# EAGLE design breakouts (EAGLE 9.0.1)
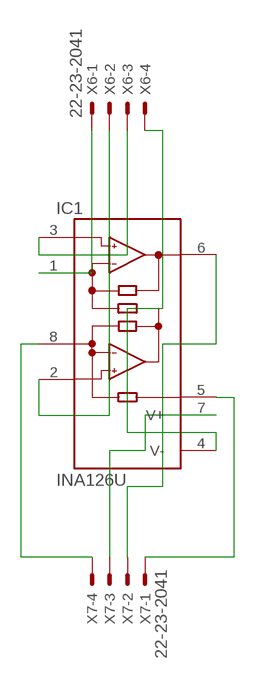
[diagram p0: schematic, sheet 1]

## Parts
IC1  INA126U  [SO08]
X6  22-23-2041  [22-23-2041]
X7  22-23-2041  [22-23-2041]

## Nets
N$6: IC1.1(RG) X6.1
N$7: IC1.2(-IN) X6.2
N$8: IC1.3(+IN) X6.3
N$9: IC1.4(V-) X6.4
N$10: IC1.5(REF) X7.1
N$11: IC1.6(OUT) X7.2
N$12: IC1.7(V+) X7.3
N$13: IC1.8(RG) X7.4

## Library data of the parts
IC1 = INA126:INA126: Instrumentation Amplifier Micropower, Single and Dual Versions; AVAILABILITY: Unavailable; DESCRIPTION: the ina126 and ina2126 are precision instrumentation amplifiers for accurate low noise differential signal acquisitio...; MF: Texas Instruments; MP: INA126; PACKAGE: TSSOP-8 Texas Instruments; PRICE: None
X6 X7 = con-molex:22-23-2041: .100" (2.54mm) Center Header - 4 Pin; MF: MOLEX; MPN: 22-23-2041; OC_FARNELL: 1462920; OC_NEWARK: 38C0355

## Board
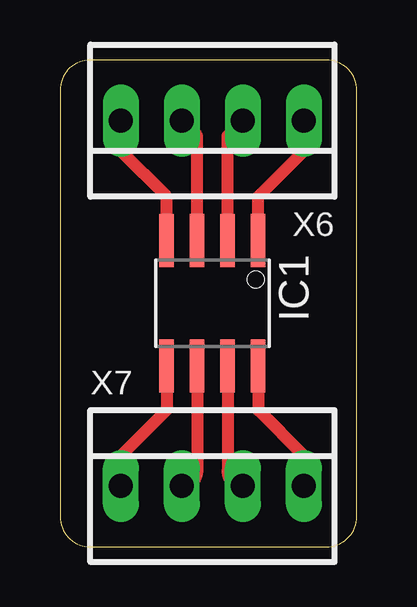
[diagram p1: board, top side]

Size 12.37 x 20.31 mm. Coordinates in mm from the lower left corner, seen from the top.
Outline: 0,19.04 0,1.27 arc90 1.27,0 11.1,0 arc90 12.37,1.27 12.37,19.04 arc90 11.1,20.31 1.27,20.31 arc90 0,19.04
Copper layers (1*16): Top 0.035mm / dielectric 1.5mm / Bottom 0.035mm
Design rules "default *": minimum track width 6mil, minimum drill 0.35mm, track to track 12mil, track to pad 12mil, pad to pad 12mil, via to via 12mil, smd to smd 12mil, copper to edge 40mil, drill to drill 6mil, minimum pad ring 10mil, minimum via ring 8mil, stop-mask expansion 4mil, vias tented up to drill 0mil, thermal gap 10mil

### Footprints (pad centres in the part's own frame; a part is rotated, then mirrored left to right if it is on the bottom)
SO08 = smd 0.61 x 2.21: 1 -1.905,-2.616; 2 -0.635,-2.616; 3 0.635,-2.616; 4 1.905,-2.616; 5 1.905,2.616; 6 0.635,2.616; 7 -0.635,2.616; 8 -1.905,2.616
22-23-2041 = drill 1 long: 1 -3.81,0; 2 -1.27,0; 3 1.27,0; 4 3.81,0

### Placement (x,y rotation side)
IC1  6.35,10.16 180 top
X6  6.35,17.78 180 top
X7  6.35,2.54 0 top

### Tracks (layer width: path | path; a pad name or v marks a point on that pad's centre or on a via)
N$6
  Top 0.508: IC1.1 8.25,14.61 10.16,16.51 X6.1
N$7
  Top 0.508: IC1.2 6.98,17.14 X6.2
N$8
  Top 0.508: IC1.3 5.71,17.14 X6.3
N$9
  Top 0.508: IC1.4 4.45,14.61 2.54,16.51 X6.4
N$10
  Top 0.508: IC1.5 4.45,5.72 2.54,3.81 X7.1
N$11
  Top 0.508: IC1.6 5.71,3.17 arc-90 X7.2
N$12
  Top 0.508: IC1.7 6.98,3.17 arc90 X7.3
N$13
  Top 0.508: IC1.8 8.25,5.72 10.16,3.81 X7.4